# Altium schematic sheet Esp32.SchDoc
size A; SheetNumber: 2; SheetTotal: 4
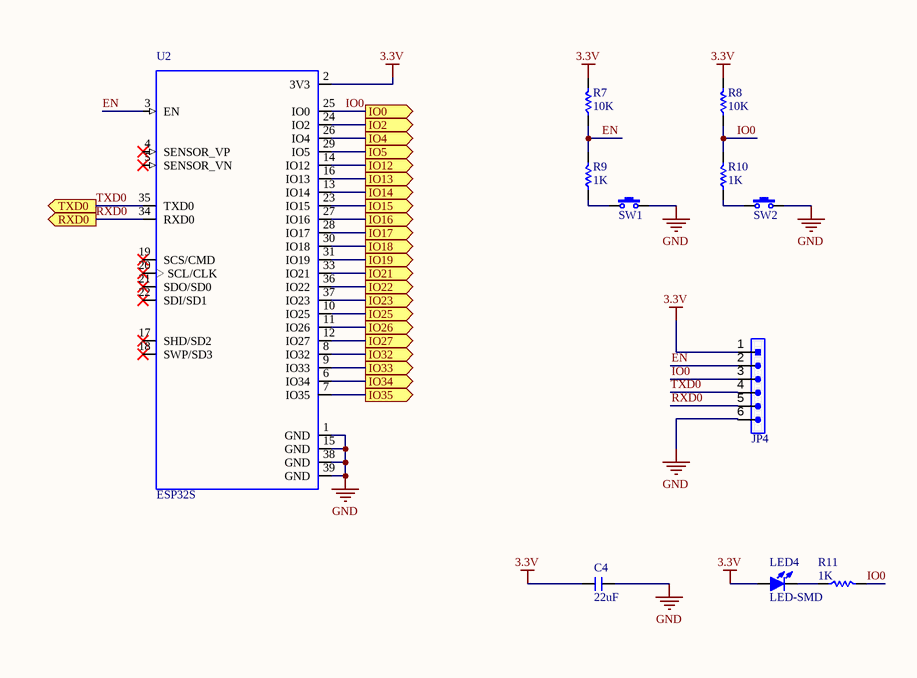
[diagram p0: Esp32.SchDoc]

## Parts
C4  22uF  [C 0805]
JP4  HDR-1X6  [HDR-1X6]  (value not drawn)
LED4  LED-SMD  [LED 0805B]
R7  10K  [R 0805]
R8  10K  [R 0805]
R9  1K  [R 0805]
R10  1K  [R 0805]
R11  1K  [R 0805]
SW1  3x6x5  [TSW SMD-3*6*2.5]  (value not drawn)
SW2  3x6x5  [TSW SMD-3*6*2.5]  (value not drawn)
U2  ESP32S  [ESP32S]

## Ports
IO0 (out), IO2 (out), IO4 (out), IO5 (out), IO12 (out), IO13 (out), IO14 (out), IO15 (out), IO16 (out), IO17 (out), IO18 (out), IO19 (out), IO21 (out), IO22 (out), IO23 (out), IO25 (out), IO26 (out), IO27 (out), IO32 (out), IO33 (out), IO34 (out), IO35 (out), RXD0 (out), TXD0 (out)

## Nets
3.3V: C4.1 JP4.1 LED4.1(A) R7.2 R8.2 U2.2(3V3)
GND: C4.2 JP4.6 SW1.2 SW2.2 U2.1(GND) U2.15(GND) U2.38(GND) U2.39(GND)
EN: JP4.2 R7.1 R9.2 U2.3(EN)
IO0: JP4.3 R8.1 R10.2 R11.2 U2.25(IO0) ; port IO0
IO2: U2.24(IO2) ; port IO2
IO4: U2.26(IO4) ; port IO4
IO5: U2.29(IO5) ; port IO5
IO12: U2.14(IO12) ; port IO12
IO13: U2.16(IO13) ; port IO13
IO14: U2.13(IO14) ; port IO14
IO15: U2.23(IO15) ; port IO15
IO16: U2.27(IO16) ; port IO16
IO17: U2.28(IO17) ; port IO17
IO18: U2.30(IO18) ; port IO18
IO19: U2.31(IO19) ; port IO19
IO21: U2.33(IO21) ; port IO21
IO22: U2.36(IO22) ; port IO22
IO23: U2.37(IO23) ; port IO23
IO25: U2.10(IO25) ; port IO25
IO26: U2.11(IO26) ; port IO26
IO27: U2.12(IO27) ; port IO27
IO32: U2.8(IO32) ; port IO32
IO33: U2.9(IO33) ; port IO33
IO34: U2.6(IO34) ; port IO34
IO35: U2.7(IO35) ; port IO35
RXD0: JP4.5 U2.34(RXD0) ; port RXD0
TXD0: JP4.4 U2.35(TXD0) ; port TXD0
NetLED4_2: LED4.2(K) R11.1
NetR9_1: R9.1 SW1.1
NetR10_1: R10.1 SW2.1

Not connected (* = marked no-connect by the designer): U2 4(SENSOR_VP)* 5(SENSOR_VN)* 17(SHD/SD2)* 18(SWP/SD3)* 19(SCS/CMD)* 20(SCL/CLK)* 21(SDO/SD0)* 22(SDI/SD1)*

## Library data of the parts
C4 = C: Non-polar patch capacitor; BOM名称: 无极性贴片电容; 版权归属: 源创客; 学习资源: www.ooocke.com
JP4 = Header 6: 6P Connector; BOM名称: 6P接插件; 版权归属: 源创客; 学习资源: www.ooocke.com
LED4 = LED-SMD: Patch LED; BOM名称: 贴片LED; 版权归属: 源创客; 学习资源: www.ooocke.com
R7-R11 = R: Chip resistor; 版权归属: 源创客; BOM名称: Chip resistor; 学习资源: www.ooocke.com
SW1 SW2 = TSW 3x6: 3x6 tact switch; BOM名称: 3x6轻触开关; 版权归属: 源创客; 学习资源: www.ooocke.com
U2 = ESP32S: MP: ESP32-WROOM-32D; MF: Espressif Systems; Package: Module Espressif Systems; Price: None; Availability: Unavailable; SnapEDA_Link: https://www.snapeda.com/parts/ESP32-WROOM-32D/Espressif%20Systems/view-part/?ref=snap; Value: *